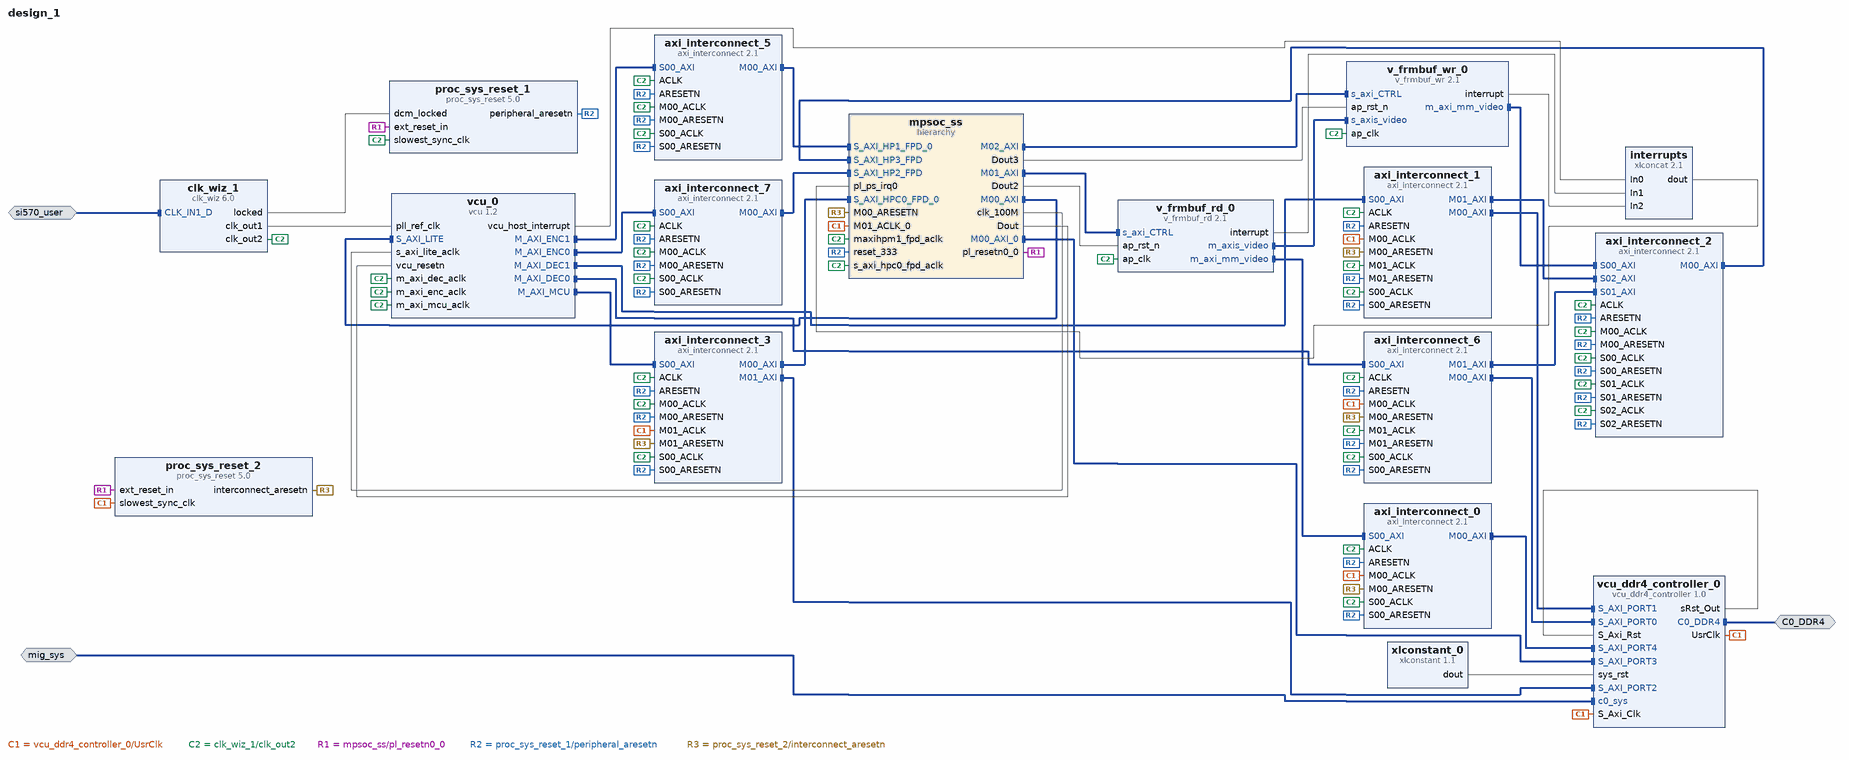
[diagram p0: block diagram of the top level]
# Vivado block design design_1, xczu7ev-ffvc1156-2-e, Vivado 2019.1
create_bd_design design_1

create_bd_intf_port -mode Master -vlnv xilinx.com:interface:ddr4_rtl:1.0 C0_DDR4
create_bd_intf_port -mode Slave -vlnv xilinx.com:interface:diff_clock_rtl:1.0 mig_sys
set_property -dict {CONFIG.FREQ_HZ 125000000} [get_bd_intf_ports mig_sys]
create_bd_intf_port -mode Slave -vlnv xilinx.com:interface:diff_clock_rtl:1.0 si570_user
set_property -dict {CONFIG.FREQ_HZ 300000000} [get_bd_intf_ports si570_user]

create_bd_cell -type ip -vlnv xilinx.com:ip:axi_interconnect:2.1 axi_interconnect_0
set_property -dict [list \
  CONFIG.M00_HAS_REGSLICE 4 \
  CONFIG.NUM_MI 1 \
  CONFIG.NUM_SI 1 \
  CONFIG.S00_HAS_REGSLICE 4 \
  CONFIG.S01_HAS_REGSLICE 4 \
  CONFIG.S02_HAS_REGSLICE 4 \
  CONFIG.S03_HAS_REGSLICE 4 \
  CONFIG.S04_HAS_REGSLICE 4 \
  CONFIG.S05_HAS_REGSLICE 4 \
  CONFIG.S06_HAS_REGSLICE 4 \
  CONFIG.S07_HAS_REGSLICE 4 \
] [get_bd_cells axi_interconnect_0]
create_bd_cell -type ip -vlnv xilinx.com:ip:axi_interconnect:2.1 axi_interconnect_1
set_property -dict [list \
  CONFIG.ENABLE_ADVANCED_OPTIONS 1 \
  CONFIG.M00_HAS_REGSLICE 4 \
  CONFIG.M01_HAS_REGSLICE 4 \
  CONFIG.NUM_MI 2 \
  CONFIG.NUM_SI 1 \
  CONFIG.S00_HAS_REGSLICE 4 \
  CONFIG.S01_HAS_REGSLICE 4 \
] [get_bd_cells axi_interconnect_1]
create_bd_cell -type ip -vlnv xilinx.com:ip:axi_interconnect:2.1 axi_interconnect_2
set_property -dict [list \
  CONFIG.M00_HAS_REGSLICE 4 \
  CONFIG.NUM_MI 1 \
  CONFIG.NUM_SI 3 \
  CONFIG.S00_HAS_REGSLICE 4 \
  CONFIG.S01_HAS_REGSLICE 4 \
] [get_bd_cells axi_interconnect_2]
create_bd_cell -type ip -vlnv xilinx.com:ip:axi_interconnect:2.1 axi_interconnect_3
set_property -dict [list \
  CONFIG.M00_HAS_REGSLICE 4 \
  CONFIG.NUM_MI 2 \
  CONFIG.NUM_SI 1 \
  CONFIG.S00_HAS_REGSLICE 4 \
  CONFIG.S01_HAS_REGSLICE 4 \
] [get_bd_cells axi_interconnect_3]
create_bd_cell -type ip -vlnv xilinx.com:ip:axi_interconnect:2.1 axi_interconnect_5
set_property -dict [list \
  CONFIG.M00_HAS_REGSLICE 4 \
  CONFIG.NUM_MI 1 \
  CONFIG.NUM_SI 1 \
  CONFIG.S00_HAS_REGSLICE 4 \
  CONFIG.S01_HAS_REGSLICE 4 \
] [get_bd_cells axi_interconnect_5]
create_bd_cell -type ip -vlnv xilinx.com:ip:axi_interconnect:2.1 axi_interconnect_6
set_property -dict [list \
  CONFIG.ENABLE_ADVANCED_OPTIONS 1 \
  CONFIG.M00_HAS_REGSLICE 4 \
  CONFIG.M01_HAS_REGSLICE 4 \
  CONFIG.NUM_MI 2 \
  CONFIG.NUM_SI 1 \
  CONFIG.S00_HAS_REGSLICE 4 \
  CONFIG.S01_HAS_REGSLICE 4 \
] [get_bd_cells axi_interconnect_6]
create_bd_cell -type ip -vlnv xilinx.com:ip:axi_interconnect:2.1 axi_interconnect_7
set_property -dict [list \
  CONFIG.M00_HAS_REGSLICE 4 \
  CONFIG.NUM_MI 1 \
  CONFIG.NUM_SI 1 \
  CONFIG.S00_HAS_REGSLICE 4 \
  CONFIG.S01_HAS_REGSLICE 4 \
] [get_bd_cells axi_interconnect_7]
create_bd_cell -type ip -vlnv xilinx.com:ip:clk_wiz:6.0 clk_wiz_1
set_property -dict [list \
  CONFIG.CLKIN1_JITTER_PS 100.000 \
  CONFIG.CLKIN1_UI_JITTER 100.000 \
  CONFIG.CLKIN2_JITTER_PS 100.000 \
  CONFIG.CLKIN2_UI_JITTER 100.000 \
  CONFIG.CLKOUT1_JITTER 139.927 \
  CONFIG.CLKOUT1_PHASE_ERROR 81.700 \
  CONFIG.CLKOUT1_REQUESTED_OUT_FREQ 33.33 \
  CONFIG.CLKOUT2_JITTER 90.657 \
  CONFIG.CLKOUT2_PHASE_ERROR 81.700 \
  CONFIG.CLKOUT2_REQUESTED_OUT_FREQ 331 \
  CONFIG.CLKOUT2_USED true \
  CONFIG.CLKOUT3_JITTER 90.370 \
  CONFIG.CLKOUT3_PHASE_ERROR 77.836 \
  CONFIG.CLKOUT3_REQUESTED_OUT_FREQ 100.000 \
  CONFIG.CLKOUT3_USED false \
  CONFIG.ENABLE_CLOCK_MONITOR false \
  CONFIG.JITTER_OPTIONS PS \
  CONFIG.MMCM_CLKFBOUT_MULT_F 13.250 \
  CONFIG.MMCM_CLKIN1_PERIOD 3.333 \
  CONFIG.MMCM_CLKIN2_PERIOD 10.0 \
  CONFIG.MMCM_CLKOUT0_DIVIDE_F 39.750 \
  CONFIG.MMCM_CLKOUT1_DIVIDE 4 \
  CONFIG.MMCM_CLKOUT2_DIVIDE 1 \
  CONFIG.MMCM_DIVCLK_DIVIDE 3 \
  CONFIG.MMCM_REF_JITTER1 0.030 \
  CONFIG.MMCM_REF_JITTER2 0.010 \
  CONFIG.NUM_OUT_CLKS 2 \
  CONFIG.PRIMITIVE MMCM \
  CONFIG.PRIM_IN_FREQ 300.000 \
  CONFIG.PRIM_SOURCE Differential_clock_capable_pin \
  CONFIG.SECONDARY_SOURCE Single_ended_clock_capable_pin \
  CONFIG.USE_INCLK_SWITCHOVER false \
  CONFIG.USE_PHASE_ALIGNMENT true \
  CONFIG.USE_RESET false \
] [get_bd_cells clk_wiz_1]
create_bd_cell -type ip -vlnv xilinx.com:ip:xlconcat:2.1 interrupts
set_property -dict {CONFIG.NUM_PORTS 3} [get_bd_cells interrupts]
create_bd_cell -type hier mpsoc_ss
create_bd_cell -type ip -vlnv xilinx.com:ip:proc_sys_reset:5.0 proc_sys_reset_1
create_bd_cell -type ip -vlnv xilinx.com:ip:proc_sys_reset:5.0 proc_sys_reset_2
create_bd_cell -type ip -vlnv xilinx.com:ip:v_frmbuf_rd:2.1 v_frmbuf_rd_0
set_property -dict [list \
  CONFIG.AXIMM_ADDR_WIDTH 64 \
  CONFIG.HAS_RGB8 0 \
  CONFIG.HAS_Y8 1 \
  CONFIG.HAS_Y_UV10 1 \
  CONFIG.HAS_Y_UV10_420 1 \
  CONFIG.HAS_Y_UV8 1 \
  CONFIG.HAS_Y_UV8_420 1 \
  CONFIG.MAX_DATA_WIDTH 10 \
  CONFIG.MAX_NR_PLANES 2 \
] [get_bd_cells v_frmbuf_rd_0]
create_bd_cell -type ip -vlnv xilinx.com:ip:v_frmbuf_wr:2.1 v_frmbuf_wr_0
set_property -dict [list \
  CONFIG.AXIMM_ADDR_WIDTH 32 \
  CONFIG.HAS_RGB8 0 \
  CONFIG.HAS_Y8 1 \
  CONFIG.HAS_Y10 1 \
  CONFIG.HAS_Y_UV10 1 \
  CONFIG.HAS_Y_UV10_420 1 \
  CONFIG.HAS_Y_UV8 1 \
  CONFIG.HAS_Y_UV8_420 1 \
  CONFIG.MAX_DATA_WIDTH 10 \
  CONFIG.MAX_NR_PLANES 2 \
] [get_bd_cells v_frmbuf_wr_0]
create_bd_cell -type ip -vlnv xilinx.com:ip:vcu:1.2 vcu_0
set_property -dict [list \
  CONFIG.ENC_BUFFER_B_FRAME 1 \
  CONFIG.ENC_BUFFER_EN true \
  CONFIG.ENC_BUFFER_MOTION_VEC_RANGE 1 \
  CONFIG.ENC_BUFFER_SIZE_ACTUAL 2408 \
  CONFIG.ENC_CODING_TYPE 1 \
  CONFIG.ENC_COLOR_DEPTH 1 \
  CONFIG.ENC_COLOR_FORMAT 1 \
  CONFIG.ENC_MEM_URAM_USED 2408 \
  CONFIG.TABLE_NO 1 \
] [get_bd_cells vcu_0]
create_bd_cell -type ip -vlnv xilinx.com:ip:vcu_ddr4_controller:1.0 vcu_ddr4_controller_0
set_property -dict [list \
  CONFIG.AddrWidth 27 \
  CONFIG.BG_WIDTH 0 \
  CONFIG.BankGroupWidth 1 \
  CONFIG.BankWidth 3 \
  CONFIG.CASLatency 17 \
  CONFIG.CLKOUT0_DIVIDE_MMCM 5 \
  CONFIG.CLKOUT1_DIVIDE_MMCM 5 \
  CONFIG.CWLatency 12 \
  CONFIG.ClkfboutMultMmcm 12 \
  CONFIG.ClkinPeriodMmcm 7998 \
  CONFIG.CompBits 10010 \
  CONFIG.DIMM_TYPE 1 \
  CONFIG.DIVCLK_DIVIDE_MMCM 1 \
  CONFIG.DRAM_SPEED_BIN 0 \
  CONFIG.DRAM_WIDTH 1 \
  CONFIG.MAddrWidth 25 \
  CONFIG.NoDataCmdSlot 1 \
  CONFIG.REF_CLK 125 \
  CONFIG.c_AddrWidth 25 \
  CONFIG.c_NbBank 8 \
  CONFIG.c_NbFifo 8 \
  CONFIG.c_nRRD_S 1 \
  CONFIG.mc_BG 7 \
  CONFIG.nFAW 10 \
  CONFIG.nRTR 14 \
  CONFIG.nWTW 18 \
  CONFIG.tCK 833 \
  CONFIG.tRPA 14333 \
] [get_bd_cells vcu_ddr4_controller_0]
create_bd_cell -type ip -vlnv xilinx.com:ip:xlconstant:1.1 xlconstant_0
set_property -dict {CONFIG.CONST_VAL 0} [get_bd_cells xlconstant_0]

# ---- hierarchy /mpsoc_ss ----
current_bd_instance /mpsoc_ss
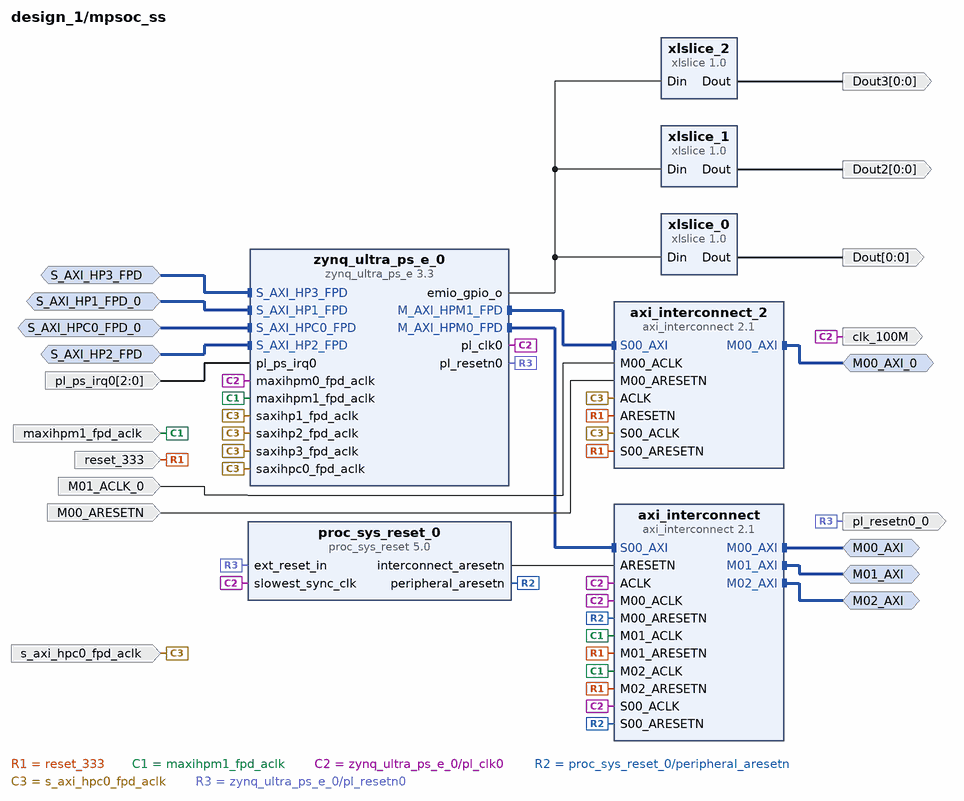
[diagram p1: block diagram inside /mpsoc_ss]
create_bd_intf_pin -mode Master -vlnv xilinx.com:interface:aximm_rtl:1.0 M00_AXI
create_bd_intf_pin -mode Master -vlnv xilinx.com:interface:aximm_rtl:1.0 M00_AXI_0
create_bd_intf_pin -mode Master -vlnv xilinx.com:interface:aximm_rtl:1.0 M01_AXI
create_bd_intf_pin -mode Master -vlnv xilinx.com:interface:aximm_rtl:1.0 M02_AXI
create_bd_intf_pin -mode Slave -vlnv xilinx.com:interface:aximm_rtl:1.0 S_AXI_HP1_FPD_0
create_bd_intf_pin -mode Slave -vlnv xilinx.com:interface:aximm_rtl:1.0 S_AXI_HP2_FPD
create_bd_intf_pin -mode Slave -vlnv xilinx.com:interface:aximm_rtl:1.0 S_AXI_HP3_FPD
create_bd_intf_pin -mode Slave -vlnv xilinx.com:interface:aximm_rtl:1.0 S_AXI_HPC0_FPD_0
create_bd_pin -dir O -from 0 -to 0 Dout
create_bd_pin -dir O -from 0 -to 0 Dout2
create_bd_pin -dir O -from 0 -to 0 Dout3
create_bd_pin -dir I -type rst M00_ARESETN
create_bd_pin -dir I -type clk M01_ACLK_0
create_bd_pin -dir O -type clk clk_100M
create_bd_pin -dir I -type clk maxihpm1_fpd_aclk
create_bd_pin -dir I -from 2 -to 0 -type intr pl_ps_irq0
create_bd_pin -dir O -type rst pl_resetn0_0
create_bd_pin -dir I -type rst reset_333
create_bd_pin -dir I -type clk s_axi_hpc0_fpd_aclk

create_bd_cell -type ip -vlnv xilinx.com:ip:zynq_ultra_ps_e:3.3 zynq_ultra_ps_e_0
set_property -dict [list \
  CONFIG.PSU_BANK_0_IO_STANDARD LVCMOS18 \
  CONFIG.PSU_BANK_1_IO_STANDARD LVCMOS18 \
  CONFIG.PSU_BANK_2_IO_STANDARD LVCMOS18 \
  CONFIG.PSU_DYNAMIC_DDR_CONFIG_EN 1 \
  CONFIG.PSU_USB3__DUAL_CLOCK_ENABLE 1 \
  CONFIG.PSU__CAN1__PERIPHERAL__ENABLE 1 \
  CONFIG.PSU__CAN1__PERIPHERAL__IO {MIO 24 .. 25} \
  CONFIG.PSU__CRF_APB__ACPU_CTRL__FREQMHZ 1200 \
  CONFIG.PSU__CRF_APB__ACPU_CTRL__SRCSEL APLL \
  CONFIG.PSU__CRF_APB__APLL_CTRL__SRCSEL PSS_REF_CLK \
  CONFIG.PSU__CRF_APB__DBG_FPD_CTRL__FREQMHZ 250 \
  CONFIG.PSU__CRF_APB__DBG_FPD_CTRL__SRCSEL IOPLL \
  CONFIG.PSU__CRF_APB__DBG_TRACE_CTRL__FREQMHZ 250 \
  CONFIG.PSU__CRF_APB__DBG_TRACE_CTRL__SRCSEL IOPLL \
  CONFIG.PSU__CRF_APB__DBG_TSTMP_CTRL__FREQMHZ 250 \
  CONFIG.PSU__CRF_APB__DBG_TSTMP_CTRL__SRCSEL IOPLL \
  CONFIG.PSU__CRF_APB__DDR_CTRL__FREQMHZ 1067 \
  CONFIG.PSU__CRF_APB__DDR_CTRL__SRCSEL DPLL \
  CONFIG.PSU__CRF_APB__DPDMA_REF_CTRL__FREQMHZ 600 \
  CONFIG.PSU__CRF_APB__DPDMA_REF_CTRL__SRCSEL APLL \
  CONFIG.PSU__CRF_APB__DPLL_CTRL__SRCSEL PSS_REF_CLK \
  CONFIG.PSU__CRF_APB__DP_AUDIO_REF_CTRL__SRCSEL RPLL \
  CONFIG.PSU__CRF_APB__DP_STC_REF_CTRL__SRCSEL RPLL \
  CONFIG.PSU__CRF_APB__DP_VIDEO_REF_CTRL__SRCSEL VPLL \
  CONFIG.PSU__CRF_APB__GDMA_REF_CTRL__FREQMHZ 600 \
  CONFIG.PSU__CRF_APB__GDMA_REF_CTRL__SRCSEL APLL \
  CONFIG.PSU__CRF_APB__GPU_REF_CTRL__FREQMHZ 500 \
  CONFIG.PSU__CRF_APB__GPU_REF_CTRL__SRCSEL IOPLL \
  CONFIG.PSU__CRF_APB__TOPSW_LSBUS_CTRL__FREQMHZ 100 \
  CONFIG.PSU__CRF_APB__TOPSW_LSBUS_CTRL__SRCSEL IOPLL \
  CONFIG.PSU__CRF_APB__TOPSW_MAIN_CTRL__FREQMHZ 533.33 \
  CONFIG.PSU__CRF_APB__TOPSW_MAIN_CTRL__SRCSEL DPLL \
  CONFIG.PSU__CRF_APB__VPLL_CTRL__SRCSEL PSS_REF_CLK \
  CONFIG.PSU__CRL_APB__ADMA_REF_CTRL__FREQMHZ 500 \
  CONFIG.PSU__CRL_APB__ADMA_REF_CTRL__SRCSEL IOPLL \
  CONFIG.PSU__CRL_APB__CAN1_REF_CTRL__FREQMHZ 100 \
  CONFIG.PSU__CRL_APB__CAN1_REF_CTRL__SRCSEL IOPLL \
  CONFIG.PSU__CRL_APB__CPU_R5_CTRL__FREQMHZ 500 \
  CONFIG.PSU__CRL_APB__CPU_R5_CTRL__SRCSEL IOPLL \
  CONFIG.PSU__CRL_APB__DBG_LPD_CTRL__FREQMHZ 250 \
  CONFIG.PSU__CRL_APB__DBG_LPD_CTRL__SRCSEL IOPLL \
  CONFIG.PSU__CRL_APB__GEM3_REF_CTRL__FREQMHZ 125 \
  CONFIG.PSU__CRL_APB__GEM3_REF_CTRL__SRCSEL IOPLL \
  CONFIG.PSU__CRL_APB__I2C0_REF_CTRL__FREQMHZ 100 \
  CONFIG.PSU__CRL_APB__I2C0_REF_CTRL__SRCSEL IOPLL \
  CONFIG.PSU__CRL_APB__I2C1_REF_CTRL__FREQMHZ 100 \
  CONFIG.PSU__CRL_APB__I2C1_REF_CTRL__SRCSEL IOPLL \
  CONFIG.PSU__CRL_APB__IOPLL_CTRL__SRCSEL PSS_REF_CLK \
  CONFIG.PSU__CRL_APB__IOU_SWITCH_CTRL__FREQMHZ 250 \
  CONFIG.PSU__CRL_APB__IOU_SWITCH_CTRL__SRCSEL IOPLL \
  CONFIG.PSU__CRL_APB__LPD_LSBUS_CTRL__FREQMHZ 100 \
  CONFIG.PSU__CRL_APB__LPD_LSBUS_CTRL__SRCSEL IOPLL \
  CONFIG.PSU__CRL_APB__LPD_SWITCH_CTRL__FREQMHZ 500 \
  CONFIG.PSU__CRL_APB__LPD_SWITCH_CTRL__SRCSEL IOPLL \
  CONFIG.PSU__CRL_APB__PCAP_CTRL__FREQMHZ 200 \
  CONFIG.PSU__CRL_APB__PCAP_CTRL__SRCSEL IOPLL \
  CONFIG.PSU__CRL_APB__PL0_REF_CTRL__FREQMHZ 100 \
  CONFIG.PSU__CRL_APB__PL0_REF_CTRL__SRCSEL IOPLL \
  CONFIG.PSU__CRL_APB__QSPI_REF_CTRL__FREQMHZ 125 \
  CONFIG.PSU__CRL_APB__QSPI_REF_CTRL__SRCSEL IOPLL \
  CONFIG.PSU__CRL_APB__RPLL_CTRL__SRCSEL PSS_REF_CLK \
  CONFIG.PSU__CRL_APB__SDIO1_REF_CTRL__FREQMHZ 200 \
  CONFIG.PSU__CRL_APB__SDIO1_REF_CTRL__SRCSEL IOPLL \
  CONFIG.PSU__CRL_APB__TIMESTAMP_REF_CTRL__FREQMHZ 100 \
  CONFIG.PSU__CRL_APB__TIMESTAMP_REF_CTRL__SRCSEL IOPLL \
  CONFIG.PSU__CRL_APB__UART0_REF_CTRL__FREQMHZ 100 \
  CONFIG.PSU__CRL_APB__UART0_REF_CTRL__SRCSEL IOPLL \
  CONFIG.PSU__CRL_APB__UART1_REF_CTRL__FREQMHZ 100 \
  CONFIG.PSU__CRL_APB__UART1_REF_CTRL__SRCSEL IOPLL \
  CONFIG.PSU__CRL_APB__USB0_BUS_REF_CTRL__FREQMHZ 250 \
  CONFIG.PSU__CRL_APB__USB0_BUS_REF_CTRL__SRCSEL IOPLL \
  CONFIG.PSU__CRL_APB__USB3_DUAL_REF_CTRL__FREQMHZ 20 \
  CONFIG.PSU__CRL_APB__USB3_DUAL_REF_CTRL__SRCSEL IOPLL \
  CONFIG.PSU__CRL_APB__USB3__ENABLE 1 \
  CONFIG.PSU__CSUPMU__PERIPHERAL__VALID 1 \
  CONFIG.PSU__DDRC__BUS_WIDTH {64 Bit} \
  CONFIG.PSU__DDRC__COMPONENTS UDIMM \
  CONFIG.PSU__DDRC__DEVICE_CAPACITY {4096 MBits} \
  CONFIG.PSU__DDRC__DRAM_WIDTH {8 Bits} \
  CONFIG.PSU__DDRC__ECC Disabled \
  CONFIG.PSU__DDRC__MEMORY_TYPE {DDR 4} \
  CONFIG.PSU__DDRC__SPEED_BIN DDR4_2133P \
  CONFIG.PSU__DDR_HIGH_ADDRESS_GUI_ENABLE 1 \
  CONFIG.PSU__DDR__INTERFACE__FREQMHZ 533.500 \
  CONFIG.PSU__DISPLAYPORT__LANE0__ENABLE 1 \
  CONFIG.PSU__DISPLAYPORT__LANE0__IO {GT Lane1} \
  CONFIG.PSU__DISPLAYPORT__LANE1__ENABLE 1 \
  CONFIG.PSU__DISPLAYPORT__LANE1__IO {GT Lane0} \
  CONFIG.PSU__DISPLAYPORT__PERIPHERAL__ENABLE 1 \
  CONFIG.PSU__DLL__ISUSED 1 \
  CONFIG.PSU__DPAUX__PERIPHERAL__ENABLE 1 \
  CONFIG.PSU__DPAUX__PERIPHERAL__IO {MIO 27 .. 30} \
  CONFIG.PSU__DP__LANE_SEL {Dual Lower} \
  CONFIG.PSU__DP__REF_CLK_FREQ 27 \
  CONFIG.PSU__DP__REF_CLK_SEL {Ref Clk3} \
  CONFIG.PSU__ENET3__FIFO__ENABLE 0 \
  CONFIG.PSU__ENET3__GRP_MDIO__ENABLE 1 \
  CONFIG.PSU__ENET3__GRP_MDIO__IO {MIO 76 .. 77} \
  CONFIG.PSU__ENET3__PERIPHERAL__ENABLE 1 \
  CONFIG.PSU__ENET3__PERIPHERAL__IO {MIO 64 .. 75} \
  CONFIG.PSU__ENET3__PTP__ENABLE 0 \
  CONFIG.PSU__ENET3__TSU__ENABLE 0 \
  CONFIG.PSU__FPGA_PL0_ENABLE 1 \
  CONFIG.PSU__GEM3_COHERENCY 0 \
  CONFIG.PSU__GEM3_ROUTE_THROUGH_FPD 0 \
  CONFIG.PSU__GEM__TSU__ENABLE 0 \
  CONFIG.PSU__GPIO0_MIO__IO {MIO 0 .. 25} \
  CONFIG.PSU__GPIO0_MIO__PERIPHERAL__ENABLE 1 \
  CONFIG.PSU__GPIO1_MIO__IO {MIO 26 .. 51} \
  CONFIG.PSU__GPIO1_MIO__PERIPHERAL__ENABLE 1 \
  CONFIG.PSU__GPIO_EMIO_WIDTH 95 \
  CONFIG.PSU__GPIO_EMIO__PERIPHERAL__ENABLE 1 \
  CONFIG.PSU__GPIO_EMIO__PERIPHERAL__IO 95 \
  CONFIG.PSU__GT__LINK_SPEED HBR \
  CONFIG.PSU__GT__PRE_EMPH_LVL_4 0 \
  CONFIG.PSU__GT__VLT_SWNG_LVL_4 0 \
  CONFIG.PSU__I2C0__PERIPHERAL__ENABLE 1 \
  CONFIG.PSU__I2C0__PERIPHERAL__IO {MIO 14 .. 15} \
  CONFIG.PSU__I2C1__PERIPHERAL__ENABLE 1 \
  CONFIG.PSU__I2C1__PERIPHERAL__IO {MIO 16 .. 17} \
  CONFIG.PSU__IOU_SLCR__IOU_TTC_APB_CLK__TTC0_SEL APB \
  CONFIG.PSU__IOU_SLCR__IOU_TTC_APB_CLK__TTC1_SEL APB \
  CONFIG.PSU__IOU_SLCR__IOU_TTC_APB_CLK__TTC2_SEL APB \
  CONFIG.PSU__IOU_SLCR__IOU_TTC_APB_CLK__TTC3_SEL APB \
  CONFIG.PSU__MAXIGP0__DATA_WIDTH 128 \
  CONFIG.PSU__OVERRIDE__BASIC_CLOCK 0 \
  CONFIG.PSU__PMU_COHERENCY 0 \
  CONFIG.PSU__PMU__AIBACK__ENABLE 0 \
  CONFIG.PSU__PMU__EMIO_GPI__ENABLE 0 \
  CONFIG.PSU__PMU__EMIO_GPO__ENABLE 0 \
  CONFIG.PSU__PMU__GPI0__ENABLE 0 \
  CONFIG.PSU__PMU__GPI1__ENABLE 0 \
  CONFIG.PSU__PMU__GPI2__ENABLE 0 \
  CONFIG.PSU__PMU__GPI3__ENABLE 0 \
  CONFIG.PSU__PMU__GPI4__ENABLE 0 \
  CONFIG.PSU__PMU__GPI5__ENABLE 0 \
  CONFIG.PSU__PMU__GPO0__ENABLE 1 \
  CONFIG.PSU__PMU__GPO0__IO {MIO 32} \
  CONFIG.PSU__PMU__GPO1__ENABLE 1 \
  CONFIG.PSU__PMU__GPO1__IO {MIO 33} \
  CONFIG.PSU__PMU__GPO2__ENABLE 1 \
  CONFIG.PSU__PMU__GPO2__IO {MIO 34} \
  CONFIG.PSU__PMU__GPO2__POLARITY low \
  CONFIG.PSU__PMU__GPO3__ENABLE 1 \
  CONFIG.PSU__PMU__GPO3__IO {MIO 35} \
  CONFIG.PSU__PMU__GPO3__POLARITY low \
  CONFIG.PSU__PMU__GPO4__ENABLE 1 \
  CONFIG.PSU__PMU__GPO4__IO {MIO 36} \
  CONFIG.PSU__PMU__GPO4__POLARITY low \
  CONFIG.PSU__PMU__GPO5__ENABLE 1 \
  CONFIG.PSU__PMU__GPO5__IO {MIO 37} \
  CONFIG.PSU__PMU__GPO5__POLARITY low \
  CONFIG.PSU__PMU__PERIPHERAL__ENABLE 1 \
  CONFIG.PSU__PMU__PLERROR__ENABLE 0 \
  CONFIG.PSU__PRESET_APPLIED 1 \
  CONFIG.PSU__PSS_REF_CLK__FREQMHZ 33.330 \
  CONFIG.PSU__QSPI_COHERENCY 0 \
  CONFIG.PSU__QSPI_ROUTE_THROUGH_FPD 0 \
  CONFIG.PSU__QSPI__GRP_FBCLK__ENABLE 1 \
  CONFIG.PSU__QSPI__GRP_FBCLK__IO {MIO 6} \
  CONFIG.PSU__QSPI__PERIPHERAL__DATA_MODE x4 \
  CONFIG.PSU__QSPI__PERIPHERAL__ENABLE 1 \
  CONFIG.PSU__QSPI__PERIPHERAL__IO {MIO 0 .. 12} \
  CONFIG.PSU__QSPI__PERIPHERAL__MODE {Dual Parallel} \
  CONFIG.PSU__SATA__LANE1__IO {GT Lane3} \
  CONFIG.PSU__SATA__PERIPHERAL__ENABLE 1 \
  CONFIG.PSU__SATA__REF_CLK_FREQ 125 \
  CONFIG.PSU__SATA__REF_CLK_SEL {Ref Clk1} \
  CONFIG.PSU__SD1_COHERENCY 0 \
  CONFIG.PSU__SD1_ROUTE_THROUGH_FPD 0 \
  CONFIG.PSU__SD1__DATA_TRANSFER_MODE 8Bit \
  CONFIG.PSU__SD1__GRP_CD__ENABLE 1 \
  CONFIG.PSU__SD1__GRP_CD__IO {MIO 45} \
  CONFIG.PSU__SD1__GRP_POW__ENABLE 1 \
  CONFIG.PSU__SD1__GRP_POW__IO {MIO 43} \
  CONFIG.PSU__SD1__GRP_WP__ENABLE 1 \
  CONFIG.PSU__SD1__GRP_WP__IO {MIO 44} \
  CONFIG.PSU__SD1__PERIPHERAL__ENABLE 1 \
  CONFIG.PSU__SD1__PERIPHERAL__IO {MIO 39 .. 51} \
  CONFIG.PSU__SD1__SLOT_TYPE {SD 3.0} \
  CONFIG.PSU__SWDT0__CLOCK__ENABLE 0 \
  CONFIG.PSU__SWDT0__PERIPHERAL__ENABLE 1 \
  CONFIG.PSU__SWDT0__RESET__ENABLE 0 \
  CONFIG.PSU__SWDT1__CLOCK__ENABLE 0 \
  CONFIG.PSU__SWDT1__PERIPHERAL__ENABLE 1 \
  CONFIG.PSU__SWDT1__RESET__ENABLE 0 \
  CONFIG.PSU__TSU__BUFG_PORT_PAIR 0 \
  CONFIG.PSU__TTC0__CLOCK__ENABLE 0 \
  CONFIG.PSU__TTC0__PERIPHERAL__ENABLE 1 \
  CONFIG.PSU__TTC0__WAVEOUT__ENABLE 0 \
  CONFIG.PSU__TTC1__CLOCK__ENABLE 0 \
  CONFIG.PSU__TTC1__PERIPHERAL__ENABLE 1 \
  CONFIG.PSU__TTC1__WAVEOUT__ENABLE 0 \
  CONFIG.PSU__TTC2__CLOCK__ENABLE 0 \
  CONFIG.PSU__TTC2__PERIPHERAL__ENABLE 1 \
  CONFIG.PSU__TTC2__WAVEOUT__ENABLE 0 \
  CONFIG.PSU__TTC3__CLOCK__ENABLE 0 \
  CONFIG.PSU__TTC3__PERIPHERAL__ENABLE 1 \
  CONFIG.PSU__TTC3__WAVEOUT__ENABLE 0 \
  CONFIG.PSU__UART0__BAUD_RATE 115200 \
  CONFIG.PSU__UART0__MODEM__ENABLE 0 \
  CONFIG.PSU__UART0__PERIPHERAL__ENABLE 1 \
  CONFIG.PSU__UART0__PERIPHERAL__IO {MIO 18 .. 19} \
  CONFIG.PSU__UART1__BAUD_RATE 115200 \
  CONFIG.PSU__UART1__MODEM__ENABLE 0 \
  CONFIG.PSU__UART1__PERIPHERAL__ENABLE 1 \
  CONFIG.PSU__UART1__PERIPHERAL__IO {MIO 20 .. 21} \
  CONFIG.PSU__USB0_COHERENCY 0 \
  CONFIG.PSU__USB0__PERIPHERAL__ENABLE 1 \
  CONFIG.PSU__USB0__PERIPHERAL__IO {MIO 52 .. 63} \
  CONFIG.PSU__USB0__REF_CLK_FREQ 26 \
  CONFIG.PSU__USB0__REF_CLK_SEL {Ref Clk2} \
  CONFIG.PSU__USB2_0__EMIO__ENABLE 0 \
  CONFIG.PSU__USB3_0__EMIO__ENABLE 0 \
  CONFIG.PSU__USB3_0__PERIPHERAL__ENABLE 1 \
  CONFIG.PSU__USB3_0__PERIPHERAL__IO {GT Lane2} \
  CONFIG.PSU__USB__RESET__MODE {Boot Pin} \
  CONFIG.PSU__USB__RESET__POLARITY {Active Low} \
  CONFIG.PSU__USE__IRQ0 1 \
  CONFIG.PSU__USE__M_AXI_GP0 1 \
  CONFIG.PSU__USE__M_AXI_GP1 1 \
  CONFIG.PSU__USE__M_AXI_GP2 0 \
  CONFIG.PSU__USE__S_AXI_GP0 1 \
  CONFIG.PSU__USE__S_AXI_GP3 1 \
  CONFIG.PSU__USE__S_AXI_GP4 1 \
  CONFIG.PSU__USE__S_AXI_GP5 1 \
  CONFIG.SUBPRESET1 Custom \
] [get_bd_cells zynq_ultra_ps_e_0]
# 105 more settings of zynq_ultra_ps_e_0 are not shown: defaults, MIO pin electricals, DDR timing, and values the tool derives
create_bd_cell -type ip -vlnv xilinx.com:ip:axi_interconnect:2.1 axi_interconnect
set_property -dict {CONFIG.NUM_MI 3} [get_bd_cells axi_interconnect]
create_bd_cell -type ip -vlnv xilinx.com:ip:axi_interconnect:2.1 axi_interconnect_2
set_property -dict {CONFIG.NUM_MI 1 CONFIG.S00_HAS_REGSLICE 4} [get_bd_cells axi_interconnect_2]
create_bd_cell -type ip -vlnv xilinx.com:ip:proc_sys_reset:5.0 proc_sys_reset_0
create_bd_cell -type ip -vlnv xilinx.com:ip:xlslice:1.0 xlslice_0
set_property -dict {CONFIG.DIN_FROM 0 CONFIG.DIN_TO 0 CONFIG.DIN_WIDTH 95} [get_bd_cells xlslice_0]
create_bd_cell -type ip -vlnv xilinx.com:ip:xlslice:1.0 xlslice_1
set_property -dict {CONFIG.DIN_FROM 1 CONFIG.DIN_TO 1 CONFIG.DIN_WIDTH 95 CONFIG.DOUT_WIDTH 1} [get_bd_cells xlslice_1]
create_bd_cell -type ip -vlnv xilinx.com:ip:xlslice:1.0 xlslice_2
set_property -dict {CONFIG.DIN_FROM 2 CONFIG.DIN_TO 2 CONFIG.DIN_WIDTH 95 CONFIG.DOUT_WIDTH 1} [get_bd_cells xlslice_2]

# ---- connections ----

current_bd_instance /mpsoc_ss
connect_bd_intf_net -intf_net intf_net_axi_interconnect_M02_AXI [get_bd_intf_pins M02_AXI] [get_bd_intf_pins axi_interconnect/M02_AXI]
connect_bd_intf_net [get_bd_intf_pins M00_AXI_0] [get_bd_intf_pins axi_interconnect_2/M00_AXI]
connect_bd_intf_net -intf_net intf_net_axi_interconnect_M01_AXI [get_bd_intf_pins M01_AXI] [get_bd_intf_pins axi_interconnect/M01_AXI]
connect_bd_intf_net [get_bd_intf_pins S_AXI_HP3_FPD] [get_bd_intf_pins zynq_ultra_ps_e_0/S_AXI_HP3_FPD]
connect_bd_intf_net [get_bd_intf_pins S_AXI_HP1_FPD_0] [get_bd_intf_pins zynq_ultra_ps_e_0/S_AXI_HP1_FPD]
connect_bd_intf_net -intf_net intf_net_axi_interconnect_M00_AXI [get_bd_intf_pins M00_AXI] [get_bd_intf_pins axi_interconnect/M00_AXI]
connect_bd_intf_net [get_bd_intf_pins axi_interconnect_2/S00_AXI] [get_bd_intf_pins zynq_ultra_ps_e_0/M_AXI_HPM1_FPD]
connect_bd_intf_net [get_bd_intf_pins axi_interconnect/S00_AXI] [get_bd_intf_pins zynq_ultra_ps_e_0/M_AXI_HPM0_FPD]
connect_bd_intf_net [get_bd_intf_pins S_AXI_HPC0_FPD_0] [get_bd_intf_pins zynq_ultra_ps_e_0/S_AXI_HPC0_FPD]
connect_bd_intf_net [get_bd_intf_pins S_AXI_HP2_FPD] [get_bd_intf_pins zynq_ultra_ps_e_0/S_AXI_HP2_FPD]
connect_bd_net -net ARESETN_1 [get_bd_pins proc_sys_reset_0/interconnect_aresetn] [get_bd_pins axi_interconnect/ARESETN]
connect_bd_net -net M00_ACLK_1 [get_bd_pins M01_ACLK_0] [get_bd_pins axi_interconnect_2/M00_ACLK]
connect_bd_net [get_bd_pins M00_ARESETN] [get_bd_pins axi_interconnect_2/M00_ARESETN]
connect_bd_net -net M17_ARESETN_1 [get_bd_pins reset_333] \
  [get_bd_pins axi_interconnect/M01_ARESETN] [get_bd_pins axi_interconnect/M02_ARESETN] \
  [get_bd_pins axi_interconnect_2/ARESETN] [get_bd_pins axi_interconnect_2/S00_ARESETN]
connect_bd_net [get_bd_pins maxihpm1_fpd_aclk] \
  [get_bd_pins axi_interconnect/M01_ACLK] [get_bd_pins axi_interconnect/M02_ACLK] \
  [get_bd_pins zynq_ultra_ps_e_0/maxihpm1_fpd_aclk]
connect_bd_net -net net_clk_wiz_clk_out1 [get_bd_pins zynq_ultra_ps_e_0/pl_clk0] \
  [get_bd_pins clk_100M] [get_bd_pins axi_interconnect/ACLK] [get_bd_pins axi_interconnect/M00_ACLK] \
  [get_bd_pins axi_interconnect/S00_ACLK] [get_bd_pins proc_sys_reset_0/slowest_sync_clk] \
  [get_bd_pins zynq_ultra_ps_e_0/maxihpm0_fpd_aclk]
connect_bd_net -net net_rst_processor_1_100M_peripheral_aresetn [get_bd_pins proc_sys_reset_0/peripheral_aresetn] \
  [get_bd_pins axi_interconnect/M00_ARESETN] [get_bd_pins axi_interconnect/S00_ARESETN]
connect_bd_net -net pl_ps_irq0_1 [get_bd_pins pl_ps_irq0] [get_bd_pins zynq_ultra_ps_e_0/pl_ps_irq0]
connect_bd_net -net saxihp2_fpd_aclk_0_1 [get_bd_pins s_axi_hpc0_fpd_aclk] \
  [get_bd_pins axi_interconnect_2/ACLK] [get_bd_pins axi_interconnect_2/S00_ACLK] \
  [get_bd_pins zynq_ultra_ps_e_0/saxihp1_fpd_aclk] [get_bd_pins zynq_ultra_ps_e_0/saxihp2_fpd_aclk] \
  [get_bd_pins zynq_ultra_ps_e_0/saxihp3_fpd_aclk] [get_bd_pins zynq_ultra_ps_e_0/saxihpc0_fpd_aclk]
connect_bd_net [get_bd_pins xlslice_0/Dout] [get_bd_pins Dout]
connect_bd_net [get_bd_pins xlslice_1/Dout] [get_bd_pins Dout2]
connect_bd_net [get_bd_pins xlslice_2/Dout] [get_bd_pins Dout3]
connect_bd_net [get_bd_pins zynq_ultra_ps_e_0/emio_gpio_o] [get_bd_pins xlslice_0/Din] [get_bd_pins xlslice_1/Din] [get_bd_pins xlslice_2/Din]
connect_bd_net [get_bd_pins zynq_ultra_ps_e_0/pl_resetn0] [get_bd_pins pl_resetn0_0] [get_bd_pins proc_sys_reset_0/ext_reset_in]

current_bd_instance /
connect_bd_intf_net -intf_net CLK_IN1_D_0_2 [get_bd_intf_ports si570_user] [get_bd_intf_pins clk_wiz_1/CLK_IN1_D]
connect_bd_intf_net [get_bd_intf_ports C0_DDR4] [get_bd_intf_pins vcu_ddr4_controller_0/C0_DDR4]
connect_bd_intf_net [get_bd_intf_pins axi_interconnect_7/S00_AXI] [get_bd_intf_pins vcu_0/M_AXI_ENC0]
connect_bd_intf_net [get_bd_intf_pins axi_interconnect_7/M00_AXI] [get_bd_intf_pins mpsoc_ss/S_AXI_HP2_FPD]
connect_bd_intf_net [get_bd_intf_pins mpsoc_ss/M02_AXI] [get_bd_intf_pins v_frmbuf_wr_0/s_axi_CTRL]
connect_bd_intf_net [get_bd_intf_pins axi_interconnect_0/S00_AXI] [get_bd_intf_pins v_frmbuf_rd_0/m_axi_mm_video]
connect_bd_intf_net [get_bd_intf_pins axi_interconnect_2/S00_AXI] [get_bd_intf_pins v_frmbuf_wr_0/m_axi_mm_video]
connect_bd_intf_net [get_bd_intf_pins mpsoc_ss/M00_AXI_0] [get_bd_intf_pins vcu_ddr4_controller_0/S_AXI_PORT3]
connect_bd_intf_net [get_bd_intf_pins v_frmbuf_rd_0/m_axis_video] [get_bd_intf_pins v_frmbuf_wr_0/s_axis_video]
connect_bd_intf_net [get_bd_intf_pins mpsoc_ss/M01_AXI] [get_bd_intf_pins v_frmbuf_rd_0/s_axi_CTRL]
connect_bd_intf_net [get_bd_intf_pins mpsoc_ss/M00_AXI] [get_bd_intf_pins vcu_0/S_AXI_LITE]
connect_bd_intf_net [get_bd_intf_pins axi_interconnect_6/S00_AXI] [get_bd_intf_pins vcu_0/M_AXI_DEC0]
connect_bd_intf_net [get_bd_intf_pins axi_interconnect_5/M00_AXI] [get_bd_intf_pins mpsoc_ss/S_AXI_HP1_FPD_0]
connect_bd_intf_net -intf_net c0_sys_0_1 [get_bd_intf_ports mig_sys] [get_bd_intf_pins vcu_ddr4_controller_0/c0_sys]
connect_bd_intf_net [get_bd_intf_pins axi_interconnect_1/M00_AXI] [get_bd_intf_pins vcu_ddr4_controller_0/S_AXI_PORT1]
connect_bd_intf_net [get_bd_intf_pins axi_interconnect_1/M01_AXI] [get_bd_intf_pins axi_interconnect_2/S02_AXI]
connect_bd_intf_net [get_bd_intf_pins axi_interconnect_3/S00_AXI] [get_bd_intf_pins vcu_0/M_AXI_MCU]
connect_bd_intf_net [get_bd_intf_pins axi_interconnect_3/M00_AXI] [get_bd_intf_pins mpsoc_ss/S_AXI_HPC0_FPD_0]
connect_bd_intf_net [get_bd_intf_pins axi_interconnect_5/S00_AXI] [get_bd_intf_pins vcu_0/M_AXI_ENC1]
connect_bd_intf_net [get_bd_intf_pins axi_interconnect_2/S01_AXI] [get_bd_intf_pins axi_interconnect_6/M01_AXI]
connect_bd_intf_net [get_bd_intf_pins axi_interconnect_2/M00_AXI] [get_bd_intf_pins mpsoc_ss/S_AXI_HP3_FPD]
connect_bd_intf_net [get_bd_intf_pins axi_interconnect_3/M01_AXI] [get_bd_intf_pins vcu_ddr4_controller_0/S_AXI_PORT2]
connect_bd_intf_net [get_bd_intf_pins axi_interconnect_0/M00_AXI] [get_bd_intf_pins vcu_ddr4_controller_0/S_AXI_PORT4]
connect_bd_intf_net [get_bd_intf_pins axi_interconnect_6/M00_AXI] [get_bd_intf_pins vcu_ddr4_controller_0/S_AXI_PORT0]
connect_bd_intf_net [get_bd_intf_pins axi_interconnect_1/S00_AXI] [get_bd_intf_pins vcu_0/M_AXI_DEC1]
connect_bd_net -net M01_ACLK_0_1 [get_bd_pins vcu_ddr4_controller_0/UsrClk] \
  [get_bd_pins axi_interconnect_0/M00_ACLK] [get_bd_pins axi_interconnect_1/M00_ACLK] \
  [get_bd_pins axi_interconnect_3/M01_ACLK] [get_bd_pins axi_interconnect_6/M00_ACLK] [get_bd_pins mpsoc_ss/M01_ACLK_0] \
  [get_bd_pins proc_sys_reset_2/slowest_sync_clk] [get_bd_pins vcu_ddr4_controller_0/S_Axi_Clk]
connect_bd_net [get_bd_pins clk_wiz_1/clk_out2] \
  [get_bd_pins axi_interconnect_0/ACLK] [get_bd_pins axi_interconnect_0/S00_ACLK] [get_bd_pins axi_interconnect_1/ACLK] \
  [get_bd_pins axi_interconnect_1/M01_ACLK] [get_bd_pins axi_interconnect_1/S00_ACLK] [get_bd_pins axi_interconnect_2/ACLK] \
  [get_bd_pins axi_interconnect_2/M00_ACLK] [get_bd_pins axi_interconnect_2/S00_ACLK] \
  [get_bd_pins axi_interconnect_2/S01_ACLK] [get_bd_pins axi_interconnect_2/S02_ACLK] [get_bd_pins axi_interconnect_3/ACLK] \
  [get_bd_pins axi_interconnect_3/M00_ACLK] [get_bd_pins axi_interconnect_3/S00_ACLK] [get_bd_pins axi_interconnect_5/ACLK] \
  [get_bd_pins axi_interconnect_5/M00_ACLK] [get_bd_pins axi_interconnect_5/S00_ACLK] [get_bd_pins axi_interconnect_6/ACLK] \
  [get_bd_pins axi_interconnect_6/M01_ACLK] [get_bd_pins axi_interconnect_6/S00_ACLK] [get_bd_pins axi_interconnect_7/ACLK] \
  [get_bd_pins axi_interconnect_7/M00_ACLK] [get_bd_pins axi_interconnect_7/S00_ACLK] \
  [get_bd_pins mpsoc_ss/maxihpm1_fpd_aclk] [get_bd_pins mpsoc_ss/s_axi_hpc0_fpd_aclk] \
  [get_bd_pins proc_sys_reset_1/slowest_sync_clk] [get_bd_pins v_frmbuf_rd_0/ap_clk] [get_bd_pins v_frmbuf_wr_0/ap_clk] \
  [get_bd_pins vcu_0/m_axi_dec_aclk] [get_bd_pins vcu_0/m_axi_enc_aclk] [get_bd_pins vcu_0/m_axi_mcu_aclk]
connect_bd_net -net clk_100M [get_bd_pins mpsoc_ss/clk_100M] [get_bd_pins vcu_0/s_axi_lite_aclk]
connect_bd_net [get_bd_pins clk_wiz_1/clk_out1] [get_bd_pins vcu_0/pll_ref_clk]
connect_bd_net [get_bd_pins clk_wiz_1/locked] [get_bd_pins proc_sys_reset_1/dcm_locked]
connect_bd_net [get_bd_pins mpsoc_ss/Dout] [get_bd_pins vcu_0/vcu_resetn]
connect_bd_net [get_bd_pins mpsoc_ss/Dout2] [get_bd_pins v_frmbuf_rd_0/ap_rst_n]
connect_bd_net [get_bd_pins mpsoc_ss/Dout3] [get_bd_pins v_frmbuf_wr_0/ap_rst_n]
connect_bd_net [get_bd_pins mpsoc_ss/pl_resetn0_0] [get_bd_pins proc_sys_reset_1/ext_reset_in] [get_bd_pins proc_sys_reset_2/ext_reset_in]
connect_bd_net -net proc_sys_reset_0_peripheral_aresetn [get_bd_pins proc_sys_reset_1/peripheral_aresetn] \
  [get_bd_pins axi_interconnect_0/ARESETN] [get_bd_pins axi_interconnect_0/S00_ARESETN] \
  [get_bd_pins axi_interconnect_1/ARESETN] [get_bd_pins axi_interconnect_1/M01_ARESETN] \
  [get_bd_pins axi_interconnect_1/S00_ARESETN] [get_bd_pins axi_interconnect_2/ARESETN] \
  [get_bd_pins axi_interconnect_2/M00_ARESETN] [get_bd_pins axi_interconnect_2/S00_ARESETN] \
  [get_bd_pins axi_interconnect_2/S01_ARESETN] [get_bd_pins axi_interconnect_2/S02_ARESETN] \
  [get_bd_pins axi_interconnect_3/ARESETN] [get_bd_pins axi_interconnect_3/M00_ARESETN] \
  [get_bd_pins axi_interconnect_3/S00_ARESETN] [get_bd_pins axi_interconnect_5/ARESETN] \
  [get_bd_pins axi_interconnect_5/M00_ARESETN] [get_bd_pins axi_interconnect_5/S00_ARESETN] \
  [get_bd_pins axi_interconnect_6/ARESETN] [get_bd_pins axi_interconnect_6/M01_ARESETN] \
  [get_bd_pins axi_interconnect_6/S00_ARESETN] [get_bd_pins axi_interconnect_7/ARESETN] \
  [get_bd_pins axi_interconnect_7/M00_ARESETN] [get_bd_pins axi_interconnect_7/S00_ARESETN] [get_bd_pins mpsoc_ss/reset_333]
connect_bd_net [get_bd_pins proc_sys_reset_2/interconnect_aresetn] \
  [get_bd_pins axi_interconnect_0/M00_ARESETN] [get_bd_pins axi_interconnect_1/M00_ARESETN] \
  [get_bd_pins axi_interconnect_3/M01_ARESETN] [get_bd_pins axi_interconnect_6/M00_ARESETN] \
  [get_bd_pins mpsoc_ss/M00_ARESETN]
connect_bd_net [get_bd_pins v_frmbuf_rd_0/interrupt] [get_bd_pins interrupts/In1]
connect_bd_net [get_bd_pins v_frmbuf_wr_0/interrupt] [get_bd_pins interrupts/In2]
connect_bd_net [get_bd_pins vcu_0/vcu_host_interrupt] [get_bd_pins interrupts/In0]
connect_bd_net -net vcu_ddr4_controller_0_sRst_o [get_bd_pins vcu_ddr4_controller_0/sRst_Out] [get_bd_pins vcu_ddr4_controller_0/S_Axi_Rst]
connect_bd_net -net xlconcat_dout [get_bd_pins interrupts/dout] [get_bd_pins mpsoc_ss/pl_ps_irq0]
connect_bd_net [get_bd_pins xlconstant_0/dout] [get_bd_pins vcu_ddr4_controller_0/sys_rst]

# ---- address map ----
assign_bd_address -offset 0x00A00F0000 -range 64K -target_address_space [get_bd_addr_spaces mpsoc_ss/zynq_ultra_ps_e_0/Data] [get_bd_addr_segs v_frmbuf_rd_0/s_axi_CTRL/Reg]
assign_bd_address -offset 0x00A0100000 -range 1M -target_address_space [get_bd_addr_spaces mpsoc_ss/zynq_ultra_ps_e_0/Data] [get_bd_addr_segs vcu_0/S_AXI_LITE/Reg]
assign_bd_address -offset 0x00A0200000 -range 64K -target_address_space [get_bd_addr_spaces mpsoc_ss/zynq_ultra_ps_e_0/Data] [get_bd_addr_segs v_frmbuf_wr_0/s_axi_CTRL/Reg]
assign_bd_address -offset 0x4800000000 -range 2G -target_address_space [get_bd_addr_spaces mpsoc_ss/zynq_ultra_ps_e_0/Data] [get_bd_addr_segs vcu_ddr4_controller_0/S_AXI_PORT3/Reg]
assign_bd_address -offset 0x0000004800000000 -range 2G -target_address_space [get_bd_addr_spaces v_frmbuf_rd_0/Data_m_axi_mm_video] [get_bd_addr_segs vcu_ddr4_controller_0/S_AXI_PORT4/Reg]
assign_bd_address -offset 0x00000000 -range 2G -target_address_space [get_bd_addr_spaces v_frmbuf_wr_0/Data_m_axi_mm_video] [get_bd_addr_segs mpsoc_ss/zynq_ultra_ps_e_0/SAXIGP5/HP3_DDR_LOW]
assign_bd_address -offset 0xC0000000 -range 512M -target_address_space [get_bd_addr_spaces v_frmbuf_wr_0/Data_m_axi_mm_video] [get_bd_addr_segs mpsoc_ss/zynq_ultra_ps_e_0/SAXIGP5/HP3_QSPI]
assign_bd_address -offset 0xFF000000 -range 16M -target_address_space [get_bd_addr_spaces v_frmbuf_wr_0/Data_m_axi_mm_video] [get_bd_addr_segs mpsoc_ss/zynq_ultra_ps_e_0/SAXIGP5/HP3_LPS_OCM]
assign_bd_address -offset 0x00000000000 -range 2G -target_address_space [get_bd_addr_spaces vcu_0/Code] [get_bd_addr_segs mpsoc_ss/zynq_ultra_ps_e_0/SAXIGP0/HPC0_DDR_LOW]
assign_bd_address -offset 0x000C0000000 -range 512M -target_address_space [get_bd_addr_spaces vcu_0/Code] [get_bd_addr_segs mpsoc_ss/zynq_ultra_ps_e_0/SAXIGP0/HPC0_QSPI]
assign_bd_address -offset 0x000FF000000 -range 16M -target_address_space [get_bd_addr_spaces vcu_0/Code] [get_bd_addr_segs mpsoc_ss/zynq_ultra_ps_e_0/SAXIGP0/HPC0_LPS_OCM]
assign_bd_address -offset 0x00800000000 -range 32G -target_address_space [get_bd_addr_spaces vcu_0/Code] [get_bd_addr_segs mpsoc_ss/zynq_ultra_ps_e_0/SAXIGP0/HPC0_DDR_HIGH]
assign_bd_address -offset 0x04800000000 -range 2G -target_address_space [get_bd_addr_spaces vcu_0/Code] [get_bd_addr_segs vcu_ddr4_controller_0/S_AXI_PORT2/Reg]
assign_bd_address -offset 0x00000000000 -range 2G -target_address_space [get_bd_addr_spaces vcu_0/DecData0] [get_bd_addr_segs mpsoc_ss/zynq_ultra_ps_e_0/SAXIGP5/HP3_DDR_LOW]
assign_bd_address -offset 0x000C0000000 -range 512M -target_address_space [get_bd_addr_spaces vcu_0/DecData0] [get_bd_addr_segs mpsoc_ss/zynq_ultra_ps_e_0/SAXIGP5/HP3_QSPI]
assign_bd_address -offset 0x000FF000000 -range 16M -target_address_space [get_bd_addr_spaces vcu_0/DecData0] [get_bd_addr_segs mpsoc_ss/zynq_ultra_ps_e_0/SAXIGP5/HP3_LPS_OCM]
assign_bd_address -offset 0x00800000000 -range 32G -target_address_space [get_bd_addr_spaces vcu_0/DecData0] [get_bd_addr_segs mpsoc_ss/zynq_ultra_ps_e_0/SAXIGP5/HP3_DDR_HIGH]
assign_bd_address -offset 0x04800000000 -range 2G -target_address_space [get_bd_addr_spaces vcu_0/DecData0] [get_bd_addr_segs vcu_ddr4_controller_0/S_AXI_PORT0/Reg]
assign_bd_address -offset 0x00000000000 -range 2G -target_address_space [get_bd_addr_spaces vcu_0/DecData1] [get_bd_addr_segs mpsoc_ss/zynq_ultra_ps_e_0/SAXIGP5/HP3_DDR_LOW]
assign_bd_address -offset 0x000C0000000 -range 512M -target_address_space [get_bd_addr_spaces vcu_0/DecData1] [get_bd_addr_segs mpsoc_ss/zynq_ultra_ps_e_0/SAXIGP5/HP3_QSPI]
assign_bd_address -offset 0x000FF000000 -range 16M -target_address_space [get_bd_addr_spaces vcu_0/DecData1] [get_bd_addr_segs mpsoc_ss/zynq_ultra_ps_e_0/SAXIGP5/HP3_LPS_OCM]
assign_bd_address -offset 0x00800000000 -range 32G -target_address_space [get_bd_addr_spaces vcu_0/DecData1] [get_bd_addr_segs mpsoc_ss/zynq_ultra_ps_e_0/SAXIGP5/HP3_DDR_HIGH]
assign_bd_address -offset 0x04800000000 -range 2G -target_address_space [get_bd_addr_spaces vcu_0/DecData1] [get_bd_addr_segs vcu_ddr4_controller_0/S_AXI_PORT1/Reg]
assign_bd_address -offset 0x00000000000 -range 2G -target_address_space [get_bd_addr_spaces vcu_0/EncData0] [get_bd_addr_segs mpsoc_ss/zynq_ultra_ps_e_0/SAXIGP4/HP2_DDR_LOW]
assign_bd_address -offset 0x000C0000000 -range 512M -target_address_space [get_bd_addr_spaces vcu_0/EncData0] [get_bd_addr_segs mpsoc_ss/zynq_ultra_ps_e_0/SAXIGP4/HP2_QSPI]
assign_bd_address -offset 0x000FF000000 -range 16M -target_address_space [get_bd_addr_spaces vcu_0/EncData0] [get_bd_addr_segs mpsoc_ss/zynq_ultra_ps_e_0/SAXIGP4/HP2_LPS_OCM]
assign_bd_address -offset 0x00800000000 -range 32G -target_address_space [get_bd_addr_spaces vcu_0/EncData0] [get_bd_addr_segs mpsoc_ss/zynq_ultra_ps_e_0/SAXIGP4/HP2_DDR_HIGH]
assign_bd_address -offset 0x00000000000 -range 2G -target_address_space [get_bd_addr_spaces vcu_0/EncData1] [get_bd_addr_segs mpsoc_ss/zynq_ultra_ps_e_0/SAXIGP3/HP1_DDR_LOW]
assign_bd_address -offset 0x000C0000000 -range 512M -target_address_space [get_bd_addr_spaces vcu_0/EncData1] [get_bd_addr_segs mpsoc_ss/zynq_ultra_ps_e_0/SAXIGP3/HP1_QSPI]
assign_bd_address -offset 0x000FF000000 -range 16M -target_address_space [get_bd_addr_spaces vcu_0/EncData1] [get_bd_addr_segs mpsoc_ss/zynq_ultra_ps_e_0/SAXIGP3/HP1_LPS_OCM]
assign_bd_address -offset 0x00800000000 -range 32G -target_address_space [get_bd_addr_spaces vcu_0/EncData1] [get_bd_addr_segs mpsoc_ss/zynq_ultra_ps_e_0/SAXIGP3/HP1_DDR_HIGH]

validate_bd_design
save_bd_design
